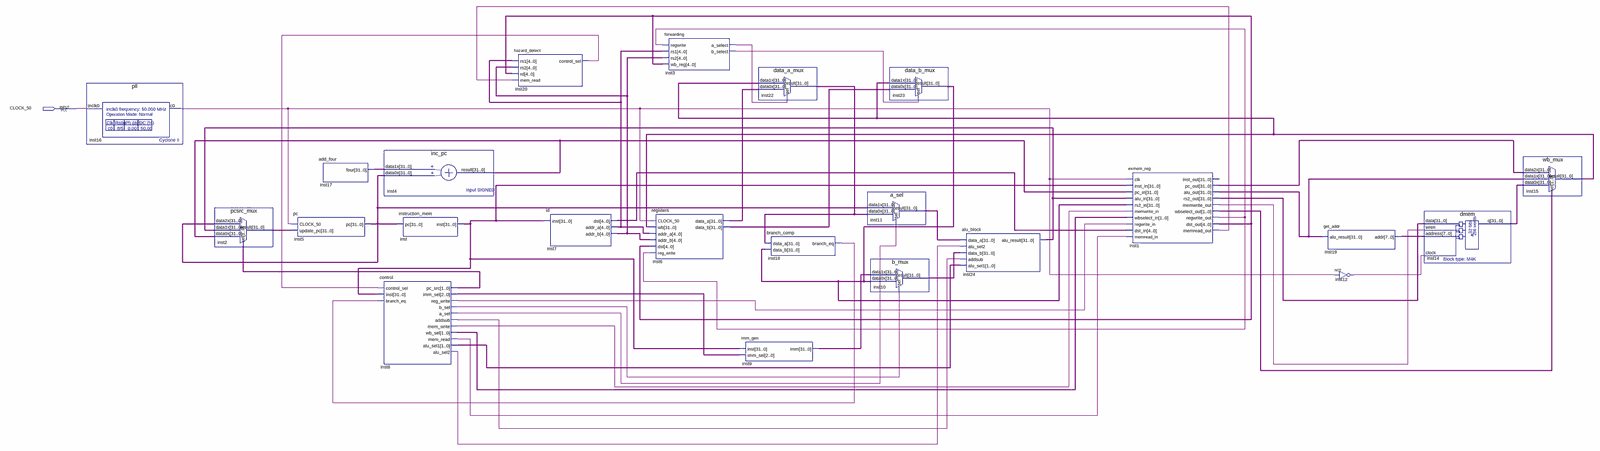
[diagram p0: schematic sheet, whole]
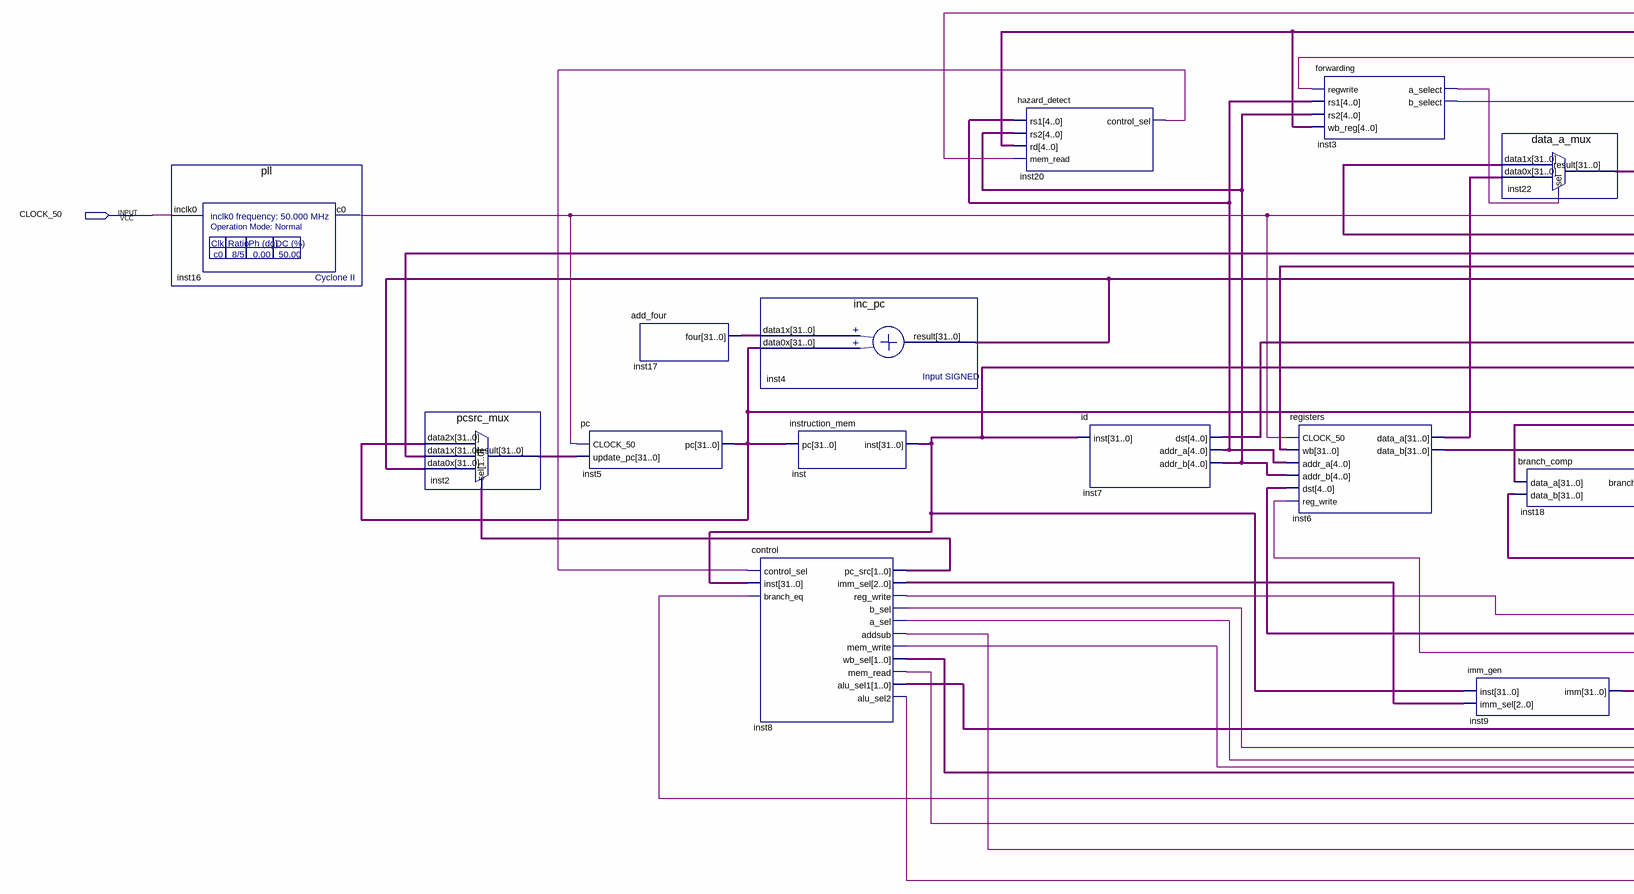
[diagram p1: schematic sheet, left part]
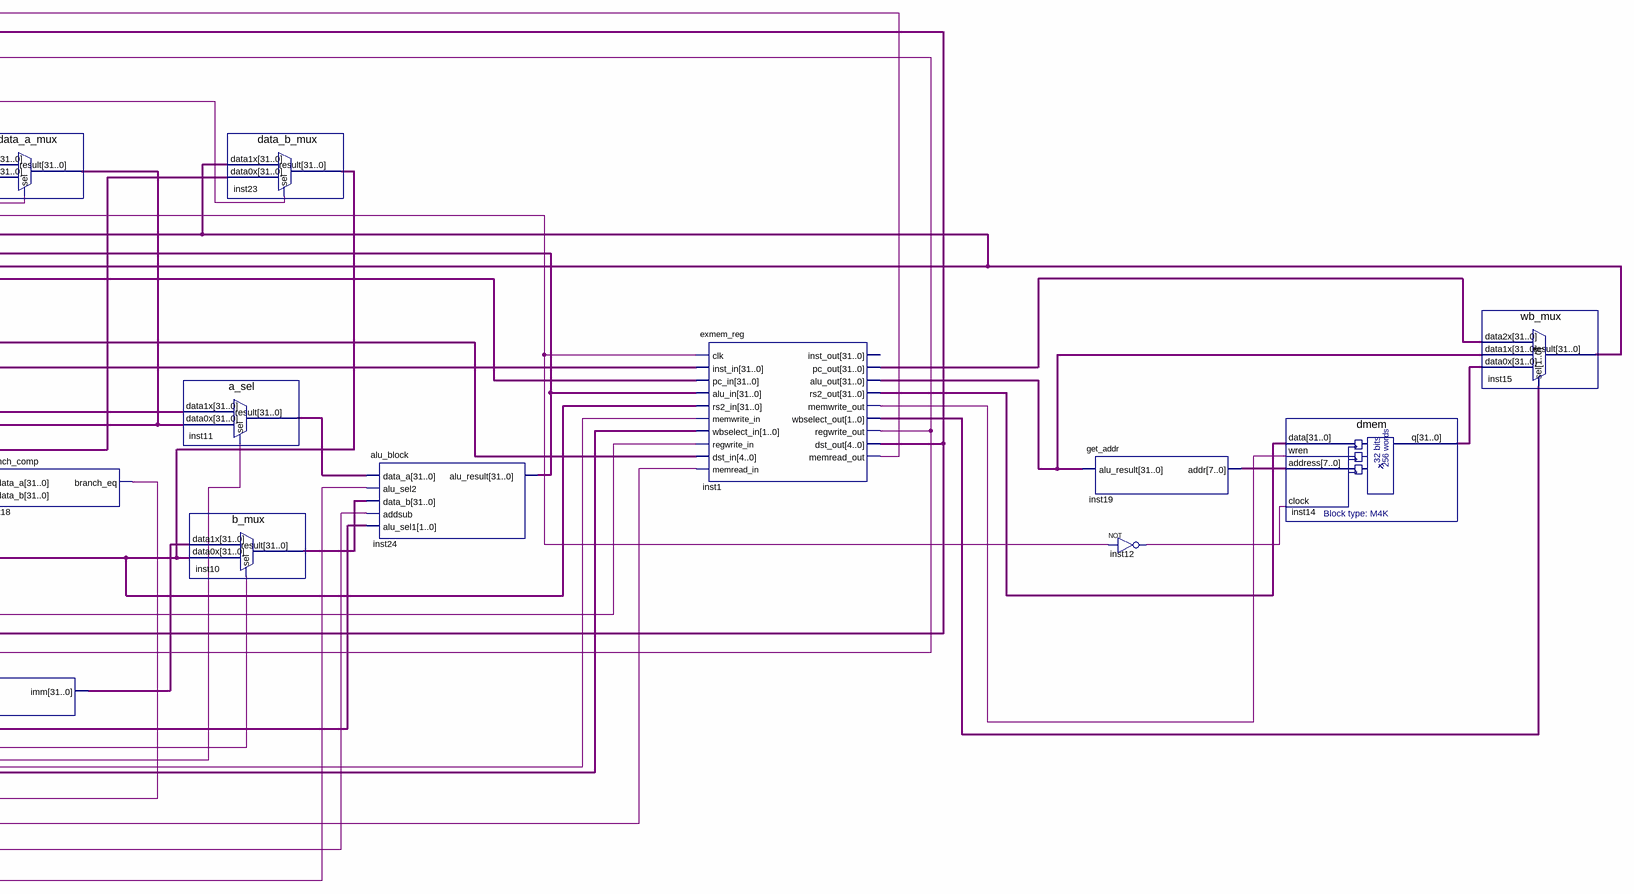
[diagram p2: schematic sheet, right part]
// Quartus schematic lil_procy.bdf as structural Verilog: 23 symbols, 1 pins
module lil_procy (
  input  CLOCK_50
);

  wire inst1_memread_out, inst1_memwrite_out, inst1_regwrite_out, inst3_a_select, inst3_b_select,
       inst8_a_sel, inst8_addsub, inst8_alu_sel2, inst8_b_sel, inst8_mem_read, inst8_mem_write,
       inst8_reg_write, inst12_out, inst16_c0, inst18_branch_eq, inst20_control_sel;
  wire [1:0] inst1_wbselect_out, inst8_alu_sel1, inst8_pc_src, inst8_wb_sel;
  wire [2:0] inst8_imm_sel;
  wire [4:0] inst1_dst_out, inst7_addr_a, inst7_addr_b, inst7_dst;
  wire [7:0] inst19_addr;
  wire [31:0] inst1_alu_out, inst1_pc_out, inst1_rs2_out, inst2_result, inst4_result, inst5_pc, inst6_data_a,
       inst6_data_b, inst9_imm, inst10_result, inst11_result, inst14_q, inst15_result, inst17_four,
       inst22_result, inst23_result, inst24_alu_result, inst_inst;

  pll inst16 (.inclk0(CLOCK_50), .c0(inst16_c0));
  pcsrc_mux inst2 (
    .data2x(inst5_pc), .data1x(inst24_alu_result), .data0x(inst4_result), .sel(inst8_pc_src),
    .result(inst2_result));
  pc inst5 (.CLOCK_50(inst16_c0), .update_pc(inst2_result), .pc(inst5_pc));
  add_four inst17 (.four(inst17_four));
  inc_pc inst4 (.data1x(inst17_four), .data0x(inst5_pc), .result(inst4_result));
  instruction_mem inst (.pc(inst5_pc), .inst(inst_inst));
  control inst8 (
    .control_sel(inst20_control_sel), .inst(inst_inst), .branch_eq(inst18_branch_eq), .pc_src(inst8_pc_src),
    .imm_sel(inst8_imm_sel), .reg_write(inst8_reg_write), .b_sel(inst8_b_sel), .a_sel(inst8_a_sel),
    .addsub(inst8_addsub), .mem_write(inst8_mem_write), .wb_sel(inst8_wb_sel), .mem_read(inst8_mem_read),
    .alu_sel1(inst8_alu_sel1), .alu_sel2(inst8_alu_sel2));
  hazard_detect inst20 (
    .rs1(inst7_addr_a), .rs2(inst7_addr_b), .rd(inst1_dst_out), .mem_read(inst1_memread_out),
    .control_sel(inst20_control_sel));
  id inst7 (.inst(inst_inst), .dst(inst7_dst), .addr_a(inst7_addr_a), .addr_b(inst7_addr_b));
  registers inst6 (
    .CLOCK_50(inst16_c0), .wb(inst15_result), .addr_a(inst7_addr_a), .addr_b(inst7_addr_b),
    .dst(inst1_dst_out), .reg_write(inst1_regwrite_out), .data_a(inst6_data_a), .data_b(inst6_data_b));
  forwarding inst3 (
    .regwrite(inst1_regwrite_out), .rs1(inst7_addr_a), .rs2(inst7_addr_b), .wb_reg(inst1_dst_out),
    .a_select(inst3_a_select), .b_select(inst3_b_select));
  data_a_mux inst22 (.data1x(inst15_result), .data0x(inst6_data_a), .sel(inst3_a_select), .result(inst22_result));
  imm_gen inst9 (.inst(inst_inst), .imm_sel(inst8_imm_sel), .imm(inst9_imm));
  branch_comp inst18 (.data_a(inst22_result), .data_b(inst23_result), .branch_eq(inst18_branch_eq));
  a_sel inst11 (.data1x(inst5_pc), .data0x(inst22_result), .sel(inst8_a_sel), .result(inst11_result));
  b_mux inst10 (.data1x(inst9_imm), .data0x(inst23_result), .sel(inst8_b_sel), .result(inst10_result));
  data_b_mux inst23 (.data1x(inst15_result), .data0x(inst6_data_b), .sel(inst3_b_select), .result(inst23_result));
  alu_block inst24 (
    .data_a(inst11_result), .alu_sel2(inst8_alu_sel2), .data_b(inst10_result), .addsub(inst8_addsub),
    .alu_sel1(inst8_alu_sel1), .alu_result(inst24_alu_result));
  exmem_reg inst1 (
    .clk(inst16_c0), .inst_in(inst_inst), .pc_in(inst4_result), .alu_in(inst24_alu_result),
    .rs2_in(inst23_result), .memwrite_in(inst8_mem_write), .wbselect_in(inst8_wb_sel),
    .regwrite_in(inst8_reg_write), .dst_in(inst7_dst), .memread_in(inst8_mem_read), .pc_out(inst1_pc_out),
    .alu_out(inst1_alu_out), .rs2_out(inst1_rs2_out), .memwrite_out(inst1_memwrite_out),
    .wbselect_out(inst1_wbselect_out), .regwrite_out(inst1_regwrite_out), .dst_out(inst1_dst_out),
    .memread_out(inst1_memread_out));  // open: inst_out
  get_addr inst19 (.alu_result(inst1_alu_out), .addr(inst19_addr));
  not inst12 (inst12_out, inst16_c0);
  dmem inst14 (
    .data(inst1_rs2_out), .wren(inst1_memwrite_out), .address(inst19_addr), .clock(inst12_out), .q(inst14_q));
  wb_mux inst15 (
    .data2x(inst1_pc_out), .data1x(inst1_alu_out), .data0x(inst14_q), .sel(inst1_wbselect_out),
    .result(inst15_result));
endmodule
